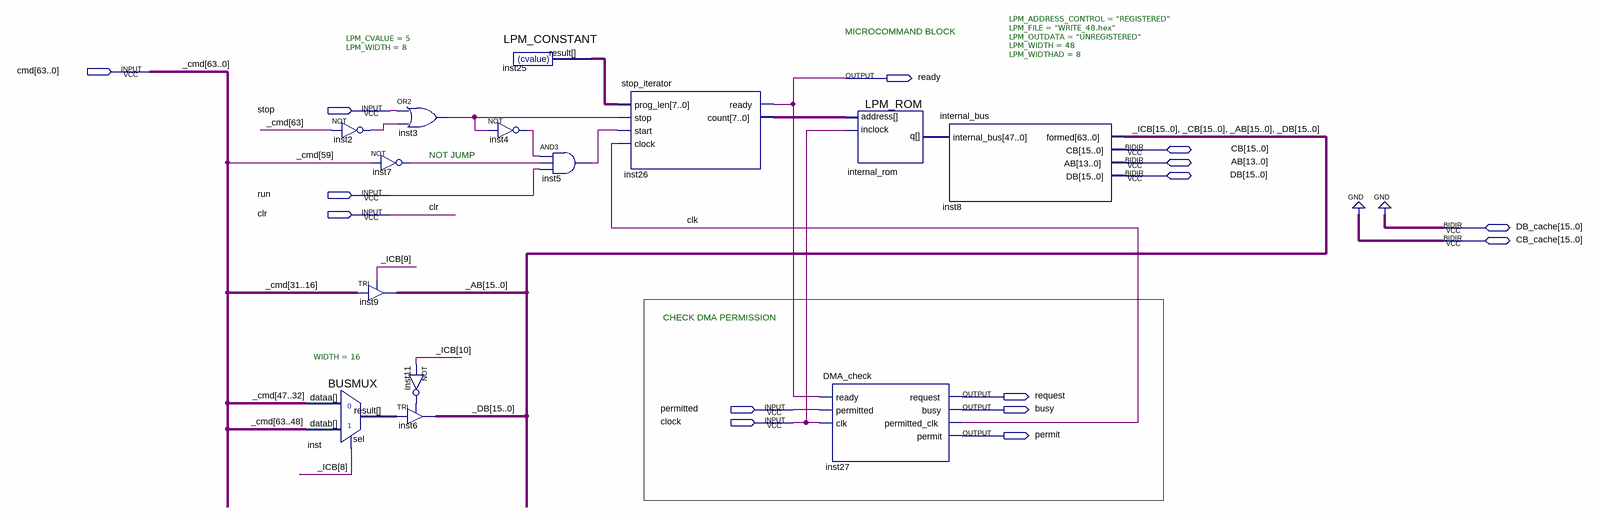
[diagram p0: schematic sheet]
// Quartus schematic WRITE.bdf as structural Verilog: 14 symbols, 15 pins
module WRITE (
  input  [63:0] cmd,
  input  stop,
  input  run,
  input  clr,
  input  permitted,
  input  clock,
  inout  [15:0] CB,
  inout  [13:0] AB,
  inout  [15:0] DB,
  inout  [15:0] DB_cache,
  inout  [15:0] CB_cache,
  output ready,
  output request,
  output busy,
  output permit
);

  wire clk, inst2_out, inst3_out, inst4_out, inst5_out, inst7_out, inst11_out;
  wire [7:0] inst25_result, inst26_count;
  wire [15:0] _AB, _CB, _DB, _ICB, inst_result;
  wire [47:0] internal_rom_q;

  not inst2 (inst2_out, cmd[63]);
  BUSMUX #(.WIDTH(16)) inst (.datab(cmd[63:48]), .sel(_ICB[8]), .dataa(cmd[47:32]), .result(inst_result));
  or inst3 (inst3_out, stop, inst2_out);
  not inst7 (inst7_out, cmd[59]);
  TRI inst9[15:0] (.IN(cmd[31:16]), .OE(_ICB[9]), .OUT(_AB));
  TRI inst6[15:0] (.IN(inst_result), .OE(inst11_out), .OUT(_DB));
  not inst11 (inst11_out, _ICB[10]);
  LPM_CONSTANT #(.LPM_CVALUE(5), .LPM_WIDTH(8)) inst25 (.result(inst25_result));
  not inst4 (inst4_out, inst3_out);
  and inst5 (inst5_out, inst4_out, inst7_out, run);
  stop_iterator inst26 (
    .prog_len(inst25_result), .stop(inst3_out), .start(inst5_out), .clock(clk), .ready(ready),
    .count(inst26_count));
  LPM_ROM #(.LPM_ADDRESS_CONTROL("REGISTERED"), .LPM_FILE("WRITE_48.hex"), .LPM_OUTDATA("UNREGISTERED"), .LPM_WIDTH(48), .LPM_WIDTHAD(8)) internal_rom (
    .address(inst26_count), .inclock(clock), .q(internal_rom_q));
  DMA_check inst27 (
    .ready(ready), .permitted(permitted), .clk(clock), .request(request), .busy(busy), .permitted_clk(clk),
    .permit(permit));
  internal_bus inst8 (.internal_bus(internal_rom_q), .formed({_ICB, _CB, _AB, _DB}), .CB(CB), .AB(AB), .DB(DB));
  // also tied to GND on the sheet: {CB_cache[0], CB_cache[1], CB_cache[2], CB_cache[3], CB_cache[4], CB_cache[5], CB_cache[6], CB_cache[7], CB_cache[8], CB_cache[9], CB_cache[10], CB_cache[11], CB_cache[12], CB_cache[13], CB_cache[14], CB_cache[15], DB_cache[0], DB_cache[1], DB_cache[2], DB_cache[3], DB_cache[4], DB_cache[5], DB_cache[6], DB_cache[7], DB_cache[8], DB_cache[9], DB_cache[10], DB_cache[11], DB_cache[12], DB_cache[13], DB_cache[14], DB_cache[15]}

  // Other names for the same wires on the sheet: _cmd[63:0] = cmd

  // Notes on the sheet:
  //   MICROCOMMAND BLOCK
  //   NOT JUMP
  //   CHECK DMA PERMISSION
endmodule
